# EAGLE design wiseboard (EAGLE 8.2.2)
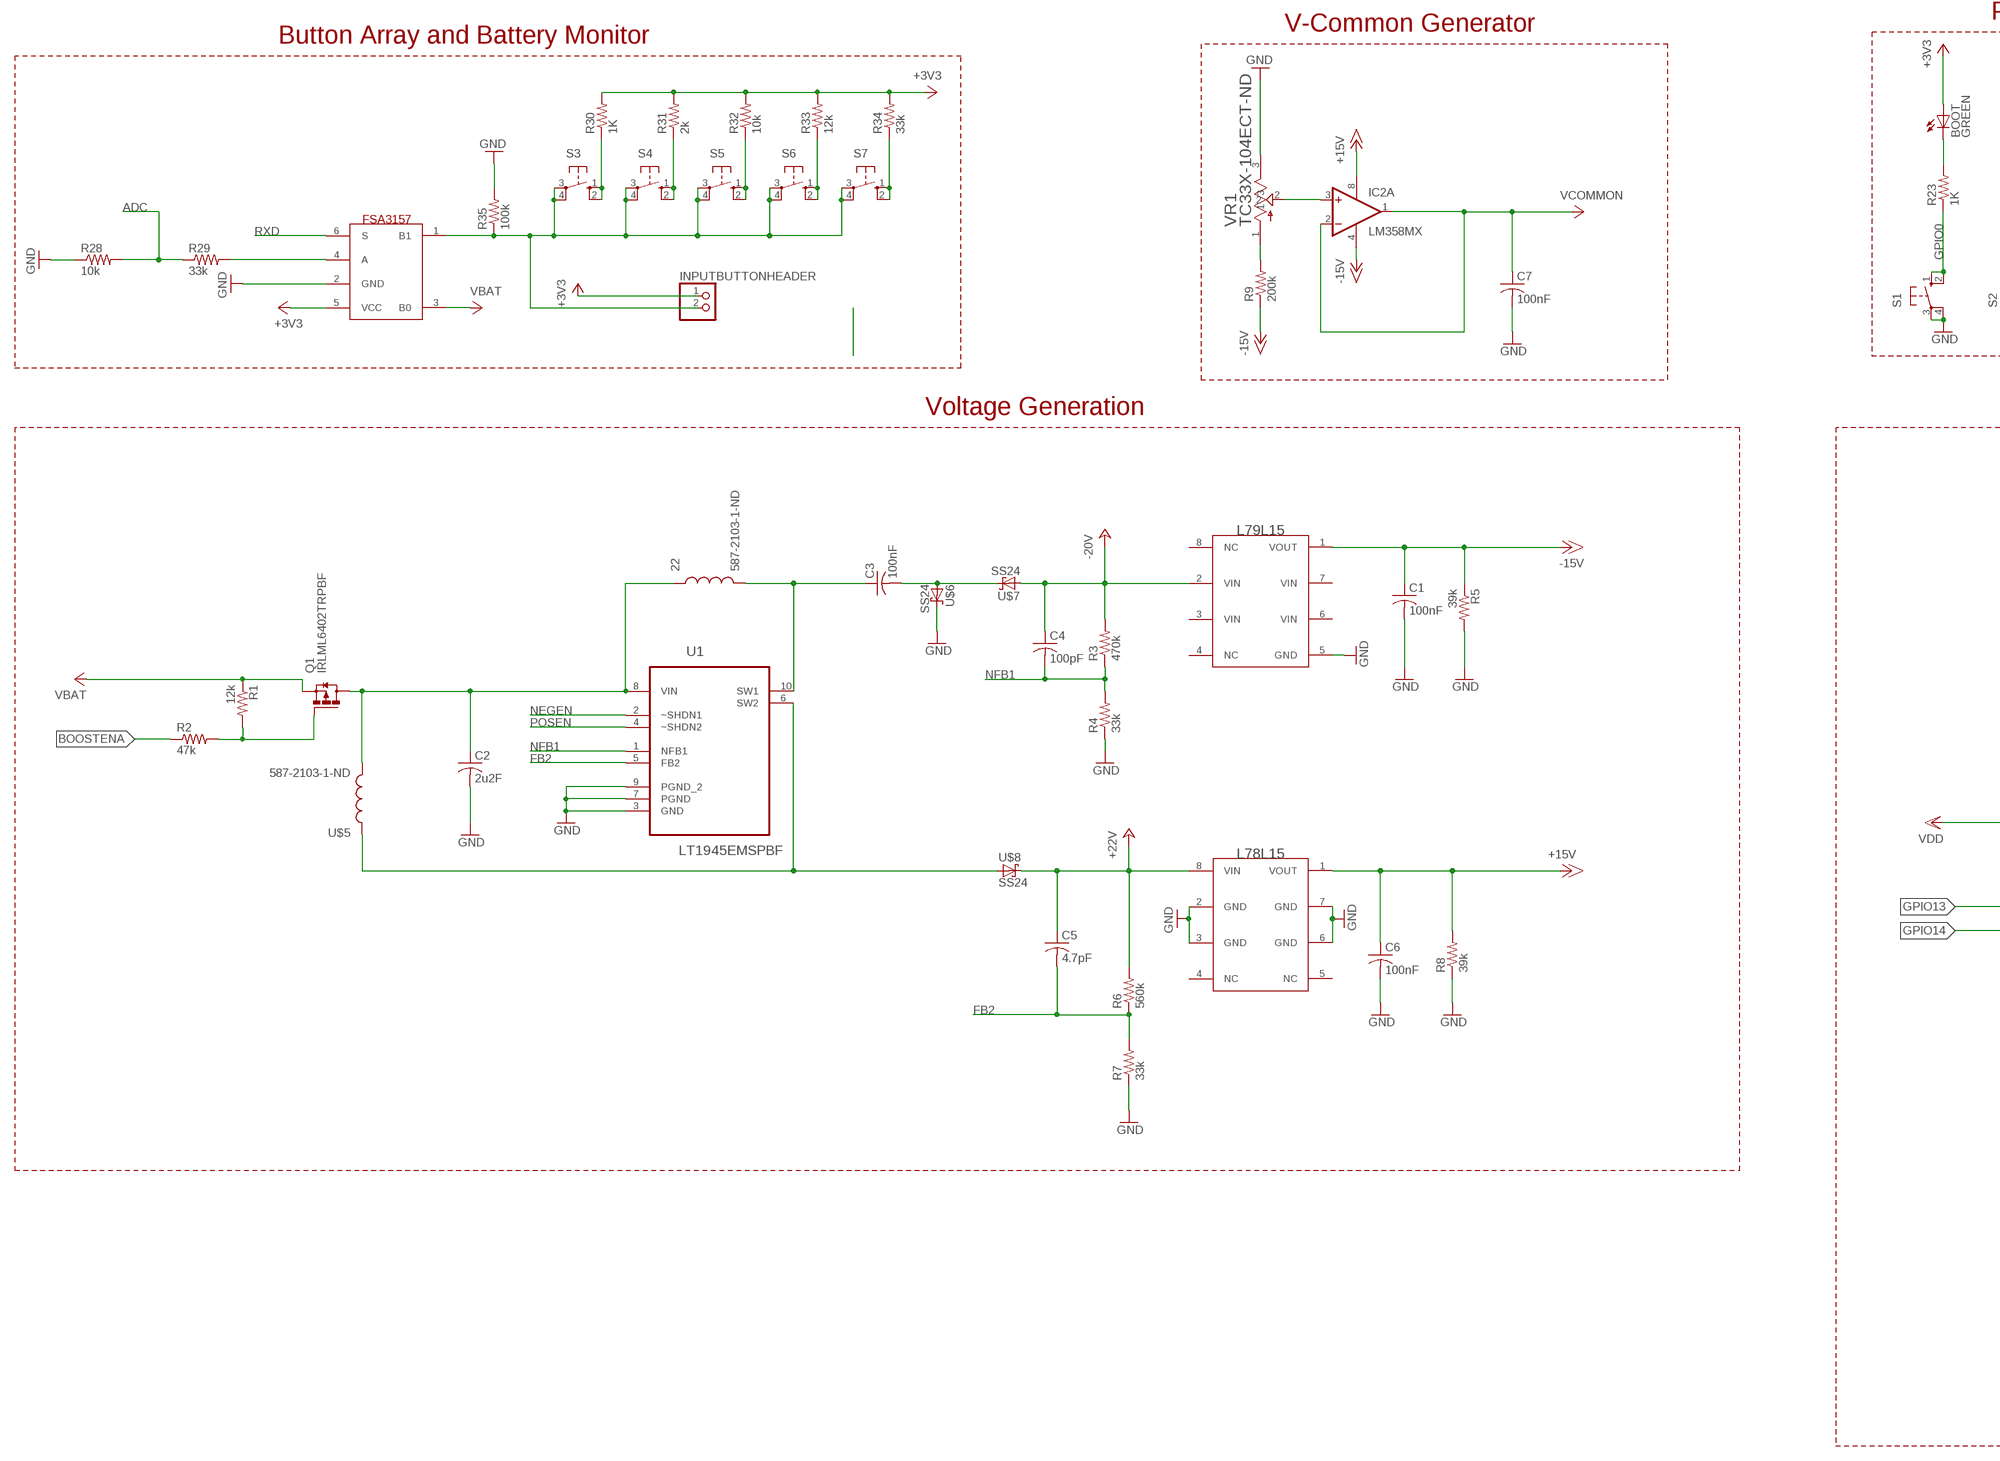
[diagram p0: schematic, sheet 1, part 1 of 2]
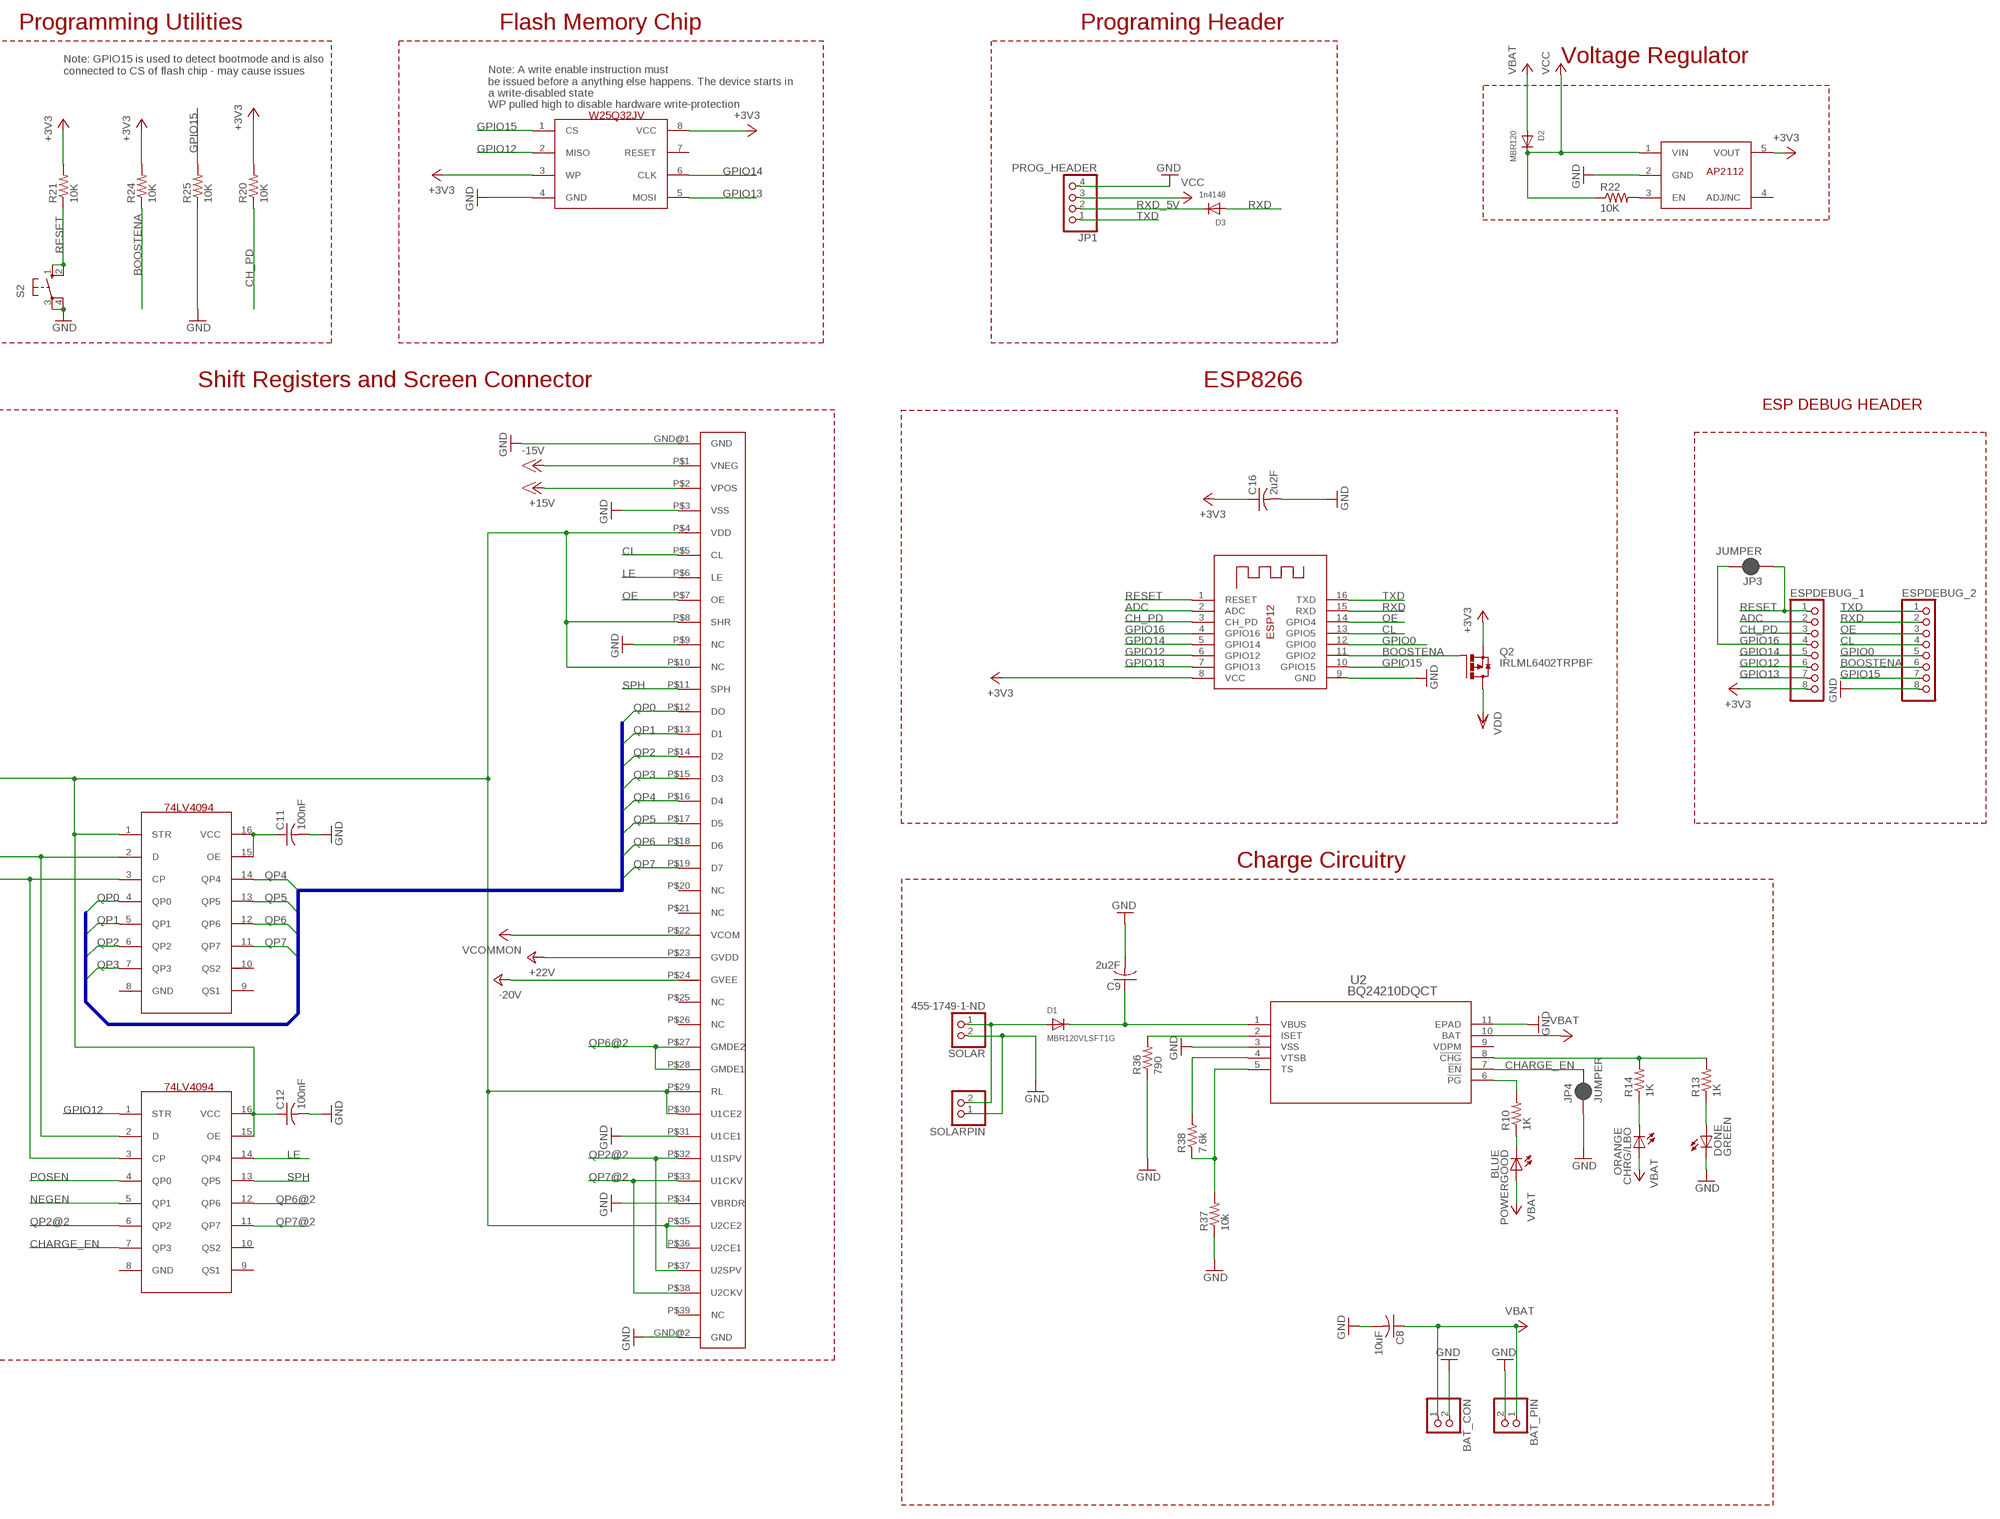
[diagram p1: schematic, sheet 1, part 2 of 2]

## Parts
22  587-2103-1-ND  [587-2103-1-ND]
BAT_CON  JST_2PIN-SMT-RA  [JST-PH-2-SMT-RA]
BAT_PIN  PINHD-1X2  [1X02]
BOOT  GREEN  LEDCHIP-LED0805  [CHIP-LED0805]
C1  100nF  C-USC1206  [C1206]
C2  2u2F  C-USC1206  [C1206]
C3  100nF  C-USC1206  [C1206]
C4  100pF  C-USC1206  [C1206]
C5  4.7pF  C-USC1206  [C1206]
C6  100nF  C-USC1206  [C1206]
C7  100nF  C-USC1206  [C1206]
C8  10uF  C-USC1206  [C1206]
C9  2u2F  C-USC1206  [C1206]
C11  100nF  C-USC1206  [C1206]
C12  100nF  C-USC1206  [C1206]
C16  2u2F  C-USC1206  [C1206]
CHRG/LBO  ORANGE  LEDCHIP-LED0805  [CHIP-LED0805]
D1  MBR120VLSFT1G  DIODESOD-123  [SOD-123]
D2  MBR120  DIODESOD-123  [SOD-123]
D3  1n4148  DIODESOD-123  [SOD-123]
DONE  GREEN  LEDCHIP-LED0805  [CHIP-LED0805]
ESPDEBUG_1  PINHD-1X8  [1X08]
ESPDEBUG_2  PINHD-1X8  [1X08]
IC2  LM358MX  [SO08]
INPUTBUTTONHEADER  PINHD-1X2  [1X02]
JP1  PROG_HEADER  PINHD-1X4  [1X04]
JP3  JUMPER  JUMPER-SMT_2_NC_PASTE_NO-SILK  [SMT-JUMPER_2_NC_PASTE_NO-SILK]
JP4  JUMPER  JUMPER-SMT_2_NC_PASTE_NO-SILK  [SMT-JUMPER_2_NC_PASTE_NO-SILK]
POWERGOOD  BLUE  LEDCHIP-LED0805  [CHIP-LED0805]
Q1  IRLML6402TRPBF  [SOT23]
Q2  IRLML6402TRPBF  [SOT23]
R1  12k  R-US_M1206  [M1206]
R2  47k  R-US_M1206  [M1206]
R3  470k  R-US_M1206  [M1206]
R4  33k  R-US_M1206  [M1206]
R5  39k  R-US_R1206  [R1206]
R6  560k  R-US_R1206  [R1206]
R7  33k  R-US_R1206  [R1206]
R8  39k  R-US_R1206  [R1206]
R9  200k  R-US_M1206  [M1206]
R10  1K  R-US_M1206  [M1206]
R13  1K  R-US_M1206  [M1206]
R14  1K  R-US_M1206  [M1206]
R20  10K  R-US_R1206  [R1206]
R21  10K  R-US_R1206  [R1206]
R22  10K  R-US_R1206  [R1206]
R23  1K  R-US_R1206  [R1206]
R24  10K  R-US_R1206  [R1206]
R25  10K  R-US_R1206  [R1206]
R28  10k  R-US_M1206  [M1206]
R29  33k  R-US_M1206  [M1206]
R30  1K  R-US_M1206  [M1206]
R31  2k  R-US_M1206  [M1206]
R32  10k  R-US_M1206  [M1206]
R33  12k  R-US_M1206  [M1206]
R34  33k  R-US_M1206  [M1206]
R35  100k  R-US_M1206  [M1206]
R36  790  R-US_R1206  [R1206]
R37  10k  R-US_R1206  [R1206]
R38  7.6k  R-US_R1206  [R1206]
S1  10-XX  [B3F-10XX]
S2  10-XX  [B3F-10XX]
S3  10-XX  [B3F-10XX]
S4  10-XX  [B3F-10XX]
S5  10-XX  [B3F-10XX]
S6  10-XX  [B3F-10XX]
S7  10-XX  [B3F-10XX]
SOLAR  455-1749-1-ND  JST_2PIN-SMT-RA  [JST-PH-2-SMT-RA]
SOLARPIN  PINHD-1X2  [1X02]
U1  LT1945EMSPBF  [SOP50P490X110-10N]
U2  BQ24210DQCT  [DQC10_P84X2P4]
U$2  497-7278-1-ND  L78L15  [SO8]
U$3  497-7303-1-ND  L79L15  [SO8]
U$4  HFQ339CT-ND  [HFQ339CT-ND]
U$5  587-2103-1-ND  [587-2103-1-ND]
U$6  SS24  [DO214AA]
U$7  SS24  [DO214AA]
U$8  SS24  [DO214AA]
U$11  1727-3473-ND  74LV4094  [SO16]
U$12  1727-3473-ND  74LV4094  [SO16]
U$13  FSA3157  [SC70-6L]
U$14  AP2112K-3.3TRG1DICT-ND  AP2112  [SOT95P280X145-5N]
U$23  W25Q32JVSSIQ  [SO8]
VR1  TC33X-104ECT-ND  TC33X-2-103E  [TRIM_TC33X-2-103E]
X1  1528-1438-ND  ESP-12  [ESP-12]

## Nets
+3V3: BOOT.A C16.1 ESPDEBUG_1.8 INPUTBUTTONHEADER.1 Q2.2(S) R20.2 R21.2 R24.2 R30.2 R31.2 R32.2 R33.2 R34.2 U$13.5(VCC) U$14.5(VOUT) U$23.3(WP) U$23.8(VCC) X1.8(VCC)
+15V: C6.1 IC2.8(P:V+) R8.2 U$2.1(VOUT) U$4.P$2(VPOS)
+22V: C5.1 R6.2 U$2.8(VIN) U$4.P$23(GVDD) U$8.C
-15V: C1.1 IC2.4(P:V-) R5.1 R9.1 U$3.1(VOUT) U$4.P$1(VNEG)
-20V: C4.1 R3.2 U$3.2(VIN) U$4.P$24(GVEE) U$7.A
ADC: ESPDEBUG_1.2 R28.2 R29.1 X1.2(ADC)
BOOSTENA: ESPDEBUG_2.6 Q2.1(G) R2.1 R24.1 X1.11(GPIO2)
CH_PD: ESPDEBUG_1.3 R20.1 X1.3(CH_PD)
CHARGE_EN: JP4.2 U2.7(!EN) U$12.7(QP3)
CL: ESPDEBUG_2.4 U$4.P$5(CL) X1.13(GPIO5)
FB2: C5.2 R6.1 R7.2 U1.5(FB2)
GND: BAT_CON.2 BAT_PIN.2 C1.2 C2.2 C6.2 C7.2 C8.2 C9.2 C11.2 C12.2 C16.2 DONE.C ESPDEBUG_2.8 JP1.4 JP4.1 R4.1 R5.2 R7.1 R8.1 R25.1 R28.1 R35.2 R36.1 R37.1 S1.3(P) S1.4(P1) S2.3(P) S2.4(P1) SOLAR.2 SOLARPIN.1 U1.3(GND) U1.7(PGND) U1.9(PGND_2) U2.3(VSS) U2.11(EPAD) U$2.2(GND) U$2.3(GND) U$2.6(GND) U$2.7(GND) U$3.5(GND) U$4.GND@1(GND) U$4.GND@2(GND) U$4.P$3(VSS) U$4.P$9(NC) U$4.P$31(U1CE1) U$4.P$34(VBRDR) U$6.C U$13.2(GND) U$14.2(GND) U$23.4(GND) VR1.3 X1.9(GND)
GPIO0: ESPDEBUG_2.5 R23.1 S1.1(S) S1.2(S1) X1.12(GPIO0)
GPIO12: ESPDEBUG_1.6 U$12.1(STR) U$23.2(MISO) X1.6(GPIO12)
GPIO13: ESPDEBUG_1.7 U$11.2(D) U$12.2(D) U$23.5(MOSI) X1.7(GPIO13)
GPIO14: ESPDEBUG_1.5 U$11.3(CP) U$12.3(CP) U$23.6(CLK) X1.5(GPIO14)
GPIO15: ESPDEBUG_2.7 R25.2 U$23.1(CS) X1.10(GPIO15)
GPIO16: ESPDEBUG_1.4 JP3.2 X1.4(GPIO16)
LE: U$4.P$6(LE) U$12.14(QP4)
N$1: IC2.3(A:+IN) VR1.2
N$2: 22.P$2 C3.1 U1.10(SW1)
N$3: Q1.1(G) R1.2 R2.2
N$4: 22.P$1 C2.1 Q1.3(D) U1.8(VIN) U$5.P$2
N$5: U1.6(SW2) U$5.P$1 U$8.A
N$6: C3.2 U$6.A U$7.C
N$7: D1.A SOLAR.1 SOLARPIN.2
N$8: R9.2 VR1.1
N$9: R10.2 U2.6(!PG)
N$10: CHRG/LBO.C R14.1
N$11: POWERGOOD.C R10.1
N$13: C9.1 D1.C U2.1(VBUS)
N$14: DONE.A R13.1
N$15: R13.2 R14.2 U2.8(!CHG)
N$16: C11.1 U$11.15(OE) U$11.16(VCC)
N$17: R36.2 U2.2(ISET)
N$22: BOOT.C R23.2
N$23: R22.2 U$14.3(EN)
N$24: R29.2 U$13.4(A)
N$26: INPUTBUTTONHEADER.2 R35.1 S3.3(P) S3.4(P1) S4.3(P) S4.4(P1) S5.3(P) S5.4(P1) S6.3(P) S6.4(P1) S7.3(P) S7.4(P1) U$13.1(B1)
N$27: R30.1 S3.1(S) S3.2(S1)
N$28: R37.2 R38.1 U2.5(TS)
N$29: R31.1 S4.1(S) S4.2(S1)
N$30: R38.2 U2.4(VTSB)
N$31: R32.1 S5.1(S) S5.2(S1)
N$33: R33.1 S6.1(S) S6.2(S1)
N$35: R34.1 S7.1(S) S7.2(S1)
NEGEN: U1.2(~SHDN1) U$12.5(QP1)
NFB1: C4.2 R3.1 R4.2 U1.1(NFB1)
OE: ESPDEBUG_2.3 U$4.P$7(OE) X1.14(GPIO4)
POSEN: U1.4(~SHDN2) U$12.4(QP0)
QP0: U$4.P$12(DO) U$11.4(QP0)
QP1: U$4.P$13(D1) U$11.5(QP1)
QP2: U$4.P$14(D2) U$11.6(QP2)
QP2@2: U$4.P$32(U1SPV) U$4.P$37(U2SPV) U$12.6(QP2)
QP3: U$4.P$15(D3) U$11.7(QP3)
QP4: U$4.P$16(D4) U$11.14(QP4)
QP5: U$4.P$17(D5) U$11.13(QP5)
QP6: U$4.P$18(D6) U$11.12(QP6)
QP6@2: U$4.P$27(GMDE2) U$4.P$28(GMDE1) U$12.12(QP6)
QP7: U$4.P$19(D7) U$11.11(QP7)
QP7@2: U$4.P$33(U1CKV) U$4.P$38(U2CKV) U$12.11(QP7)
RESET: ESPDEBUG_1.1 JP3.1 R21.1 S2.1(S) S2.2(S1) X1.1(RESET)
RXD: D3.A ESPDEBUG_2.2 U$13.6(S) X1.15(RXD)
RXD_5V: D3.C JP1.2
SPH: U$4.P$11(SPH) U$12.13(QP5)
TXD: ESPDEBUG_2.1 JP1.1 X1.16(TXD)
VBAT: BAT_CON.1 BAT_PIN.1 C8.1 CHRG/LBO.A D2.A POWERGOOD.A Q1.2(S) R1.1 U2.10(BAT) U$13.3(B0)
VCC: D2.C JP1.3 R22.1 U$14.1(VIN)
VCOMMON: C7.1 IC2.1(A:OUT) IC2.2(A:-IN) U$4.P$22(VCOM)
VDD: C12.1 Q2.3(D) U$4.P$4(VDD) U$4.P$8(SHR) U$4.P$10(NC) U$4.P$29(RL) U$4.P$30(U1CE2) U$4.P$35(U2CE2) U$4.P$36(U2CE1) U$11.1(STR) U$12.15(OE) U$12.16(VCC)
Unconnected: IC2.5(B:+IN) IC2.6(B:-IN) IC2.7(B:OUT) U2.9(VDPM) U$2.4(NC) U$2.5(NC) U$3.3(VIN) U$3.4(NC) U$3.6(VIN) U$3.7(VIN) U$3.8(NC) U$4.P$20(NC) U$4.P$21(NC) U$4.P$25(NC) U$4.P$26(NC) U$4.P$39(NC) U$11.9(QS1) U$11.10(QS2) U$12.9(QS1) U$12.10(QS2) U$14.4(ADJ/NC) U$23.7(RESET)

## Buses
QP[0..7]

## Notes on the sheet
- Programming Utilities | Flash Memory Chip | Programing Header
- V-Common Generator
- Button Array and Battery Monitor
- Voltage Regulator
- Note: GPIO15 is used to detect bootmode and is also 
  connected to CS of flash chip - may cause issues
- Note: A write enable instruction must
  be issued before a anything else happens. The device starts in 
  a write-disabled state
- WP pulled high to disable hardware write-protection
- Shift Registers and Screen Connector | ESP8266
- Voltage Generation
- ESP DEBUG HEADER
- Charge Circuitry

## Power pins joined to a net without a drawn wire
GND: U$11.8(GND) U$12.8(GND)

## Library data of the parts
22 U$5 = WISE:587-2103-1-ND
BAT_CON SOLAR = adafruit:JST_2PIN: JST 2-Pin Connectors of various flavors SMT-RA (S2B-PH-SM4) 4UConnector #17311 SMT (B2B-PH-SM4) THM-RA (S2B-PH) THM (B2B-PH)
BAT_PIN INPUTBUTTONHEADER SOLARPIN = pinhead:PINHD-1X2: PIN HEADER
BOOT CHRG/LBO DONE POWERGOOD = adafruit:LED: LED OSRAM: - CHIPLED LG R971, LG N971, LY N971, LG Q971, LY Q971, LO R971, LY R971 LH N974, LH R974 LS Q976, LO Q976, LY Q976 LO Q996 - Hyper CHIPLED LW Q18S LB Q993, LB Q99A, LB R99A - SideLED LS A670, LO A670, LY A670, LG A670, LP A670 LB A673, LV A673, LT A673, LW A673 LH A674 LY A675 LS A676, LA A676, LO A676, LY A676, LW A676 LS A679, LY A679, LG A679 - Hyper Micro SIDELED® LS Y876, LA Y876, LO Y876, LY Y876 LT Y87S - SmartLED LW L88C, LW L88S LB L89C, LB L89S, LG L890 LS L89K, LO L89K, LY L89K LS L896, LA L896, LO L896, LY L896 - TOPLED LS T670, LO T670, LY T670, LG T670, LP T670 LSG T670, LSP T670, LSY T670, LOP T670, LYG T670 LG T671, LOG T671, LSG T671 LB T673, LV T673, LT T673, LW T673 LH T674 LS T676, LA T676, LO T676, LY T676, LB T676, LH T676, LSB T676, LW T676 LB T67C, LV T67C, LT T67C, LS T67K, LO T67K, LY T67K, LW E67C LS E67B, LA E67B, LO E67B, LY E67B, LB E67C, LV E67C, LT E67C LW T67C LS T679, LY T679, LG T679 LS T770, LO T770, LY T770, LG T770, LP T770 LB T773, LV T773, LT T773, LW T773 LH T774 LS E675, LA E675, LY E675, LS T675 LS T776, LA T776, LO T776, LY T776, LB T776 LHGB T686 LT T68C, LB T68C - Hyper Mini TOPLED® LB M676 - Mini TOPLED Santana® LG M470 LS M47K, LO M47K, LY M47K Source: http://www.osram.convergy.de/
C1-C9 C11 C12 C16 = adafruit:C-US: CAPACITOR, American symbol
D1 = microbuilder:DIODE: Diode
D2 D3 = adafruit:DIODE: Diode
ESPDEBUG_1 ESPDEBUG_2 = pinhead:PINHD-1X8: PIN HEADER
IC2 = linear:LM358: OP AMP also LM158; LM258; LM2904 Source: http://cache.national.com/ds/LM/LM158.pdf
JP1 = pinhead:PINHD-1X4: PIN HEADER
JP3 JP4 = Sparkfun-Passives:JUMPER-SMT_2_NC_PASTE: Normally closed solder jumper This jumper has an aperture in the stencil to allow solder paste to bridge the split in the wire so it's normally closed (NC). Wick off the solder to open the connection. Reapply solder to reclose the connection.
Q1 Q2 = IRLML6402:IRLML6402: HEXFET P-Channel Power MOSFET; AVAILABILITY: Unavailable; DESCRIPTION: MOSFETs, Semiconductors and Actives, mosfet, Transistors, Discretes (diodes, transistors, thyristors ...); MF: International Rectifier; MP: IRLML6402; PACKAGE: SOT-23-3 International Rectifier; PRICE: None
R1-R10 R13 R14 R20-R25 R28-R38 = adafruit:R-US_: RESISTOR, American symbol
S1-S7 = switch-omron:10-XX: OMRON SWITCH; MPN: B3F-1000; OC_FARNELL: 176432; OC_NEWARK: 36M3542
U1 = LTC_By_element14_Batch_1:LT1945EMSPBF: Dual Micropower DC/DC Converter with Positive and Converter with Positive and; MPN: LT1945EMS#PBF; OC_FARNELL: 1273495; OC_NEWARK: 57M7266; PACKAGE: MSOP-10; SUPPLIER: Linear Technology
U2 = WISE:BQ24210DQCT; MANUFACTURER_PART_NUMBER: BQ24210DQCT; VENDOR: Vendor
U$2 = WISE:L78L15
U$3 = WISE:L79L15
U$4 = WISE:HFQ339CT-ND
U$6-U$8 = WISE:SS24
U$11 U$12 = WISE:74LV4094
U$13 = WISE:FSA3157
U$14 = WISE:AP2112
U$23 = WISE:W25Q32JVSSIQ
VR1 = WISE:TC33X-2-103E: Res Cermet POT 10K Ohm 25% 0.1W(1/10W) 1(Elec)/1(Mech)Turn 3mm (3 X 3.65 X 1.85mm) Foot Print SMD T/R; AVAILABILITY: Good; DESCRIPTION: Res%20Trimmer%2010K%20Ohm%2025%25%200.1W%281/10W%29%201%28Elec%29/1%28Mech%29Turn%20%283%20X%203.8mm%29%20Foot%20Print%20SMD%20Embossed%20T/R; MF: Bourns; MP: TC33X-2-103E; PACKAGE: None; PRICE: 0.16 USD
X1 = adafruit:ESP-12

## Board
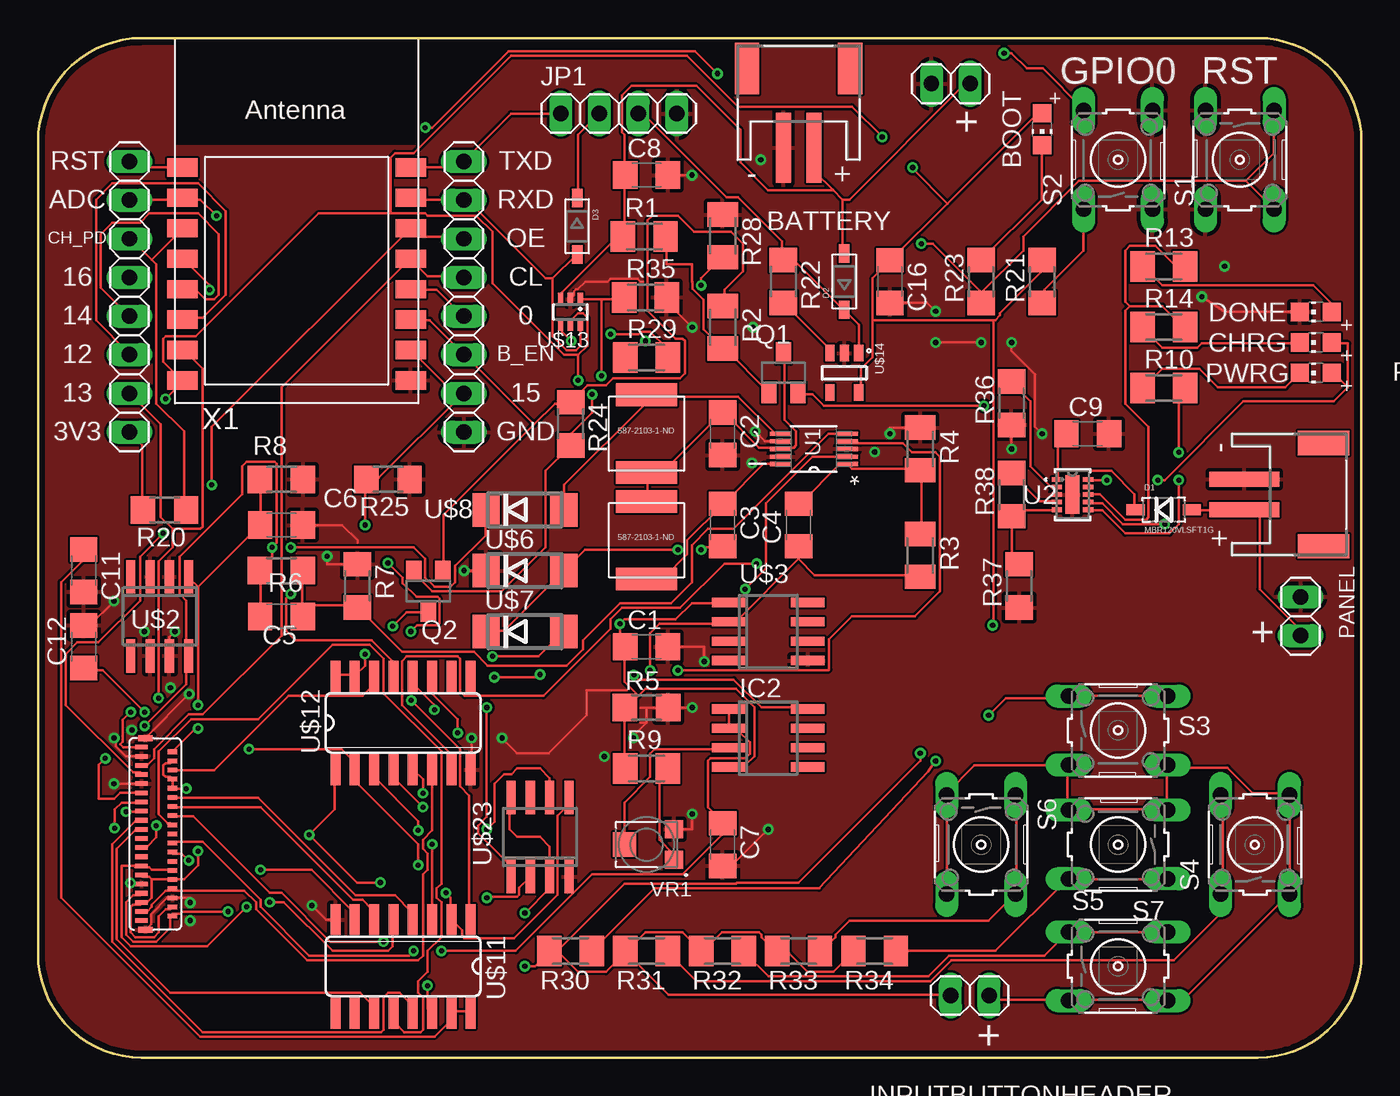
[diagram p2: board, top side]
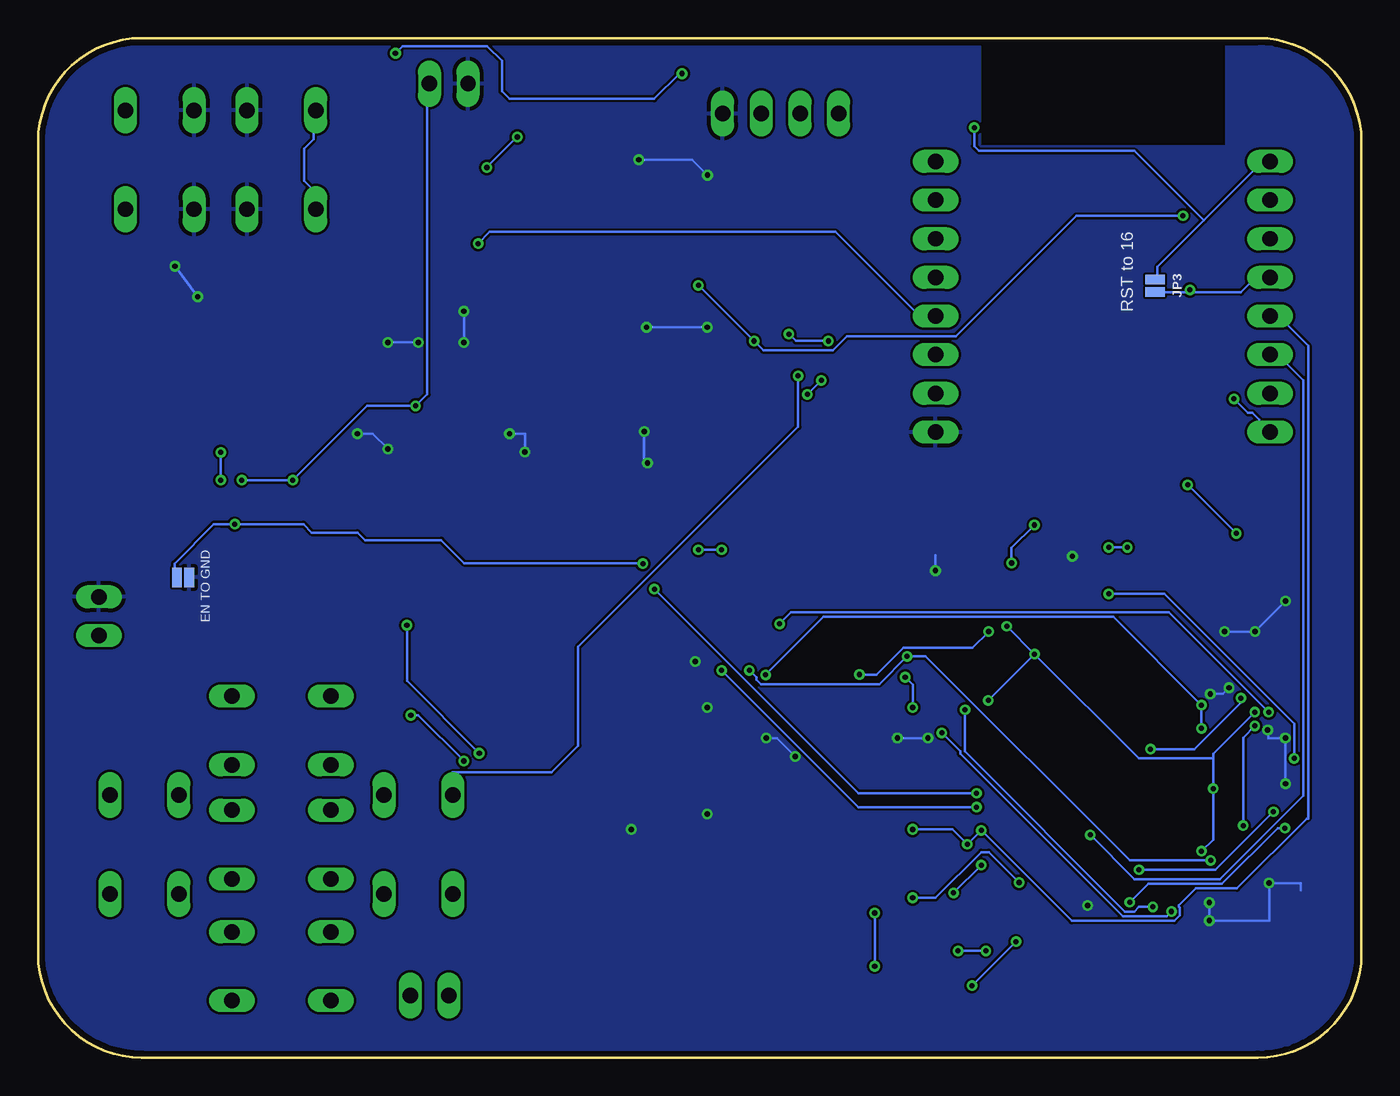
[diagram p3: board, bottom side, seen from below]

Size 87 x 67 mm. Coordinates in mm from the lower left corner, seen from the top.
Outline: 80.17,0 6.83,0 arc-90 0,6.83 0,60.17 arc-90 6.83,67 80.17,67 arc-90 87,60.17 87,6.83 arc-90 80.17,0
Copper layers (1*16): Top 0.0356mm / dielectric 1.5011mm / Bottom 0.0356mm
Design rules "oshpark-2layer": minimum track width 6mil, minimum drill 13mil, track to track 6mil, track to pad 6mil, pad to pad 6mil, via to via 6mil, smd to smd 6mil, copper to edge 15mil, drill to drill 6mil, minimum pad ring 7mil, minimum via ring 7mil, stop-mask expansion 2.5mil, vias tented up to drill 0mil, thermal gap 10mil

### Footprints (pad centres in the part's own frame; a part is rotated, then mirrored left to right if it is on the bottom)
587-2103-1-ND = smd 1.5 x 4: P$1 -2.55,0; P$2 2.55,0
JST-PH-2-SMT-RA = smd 1 x 4.6: 1 1,-3.7; 2 -1,-3.7 | smd 1.6 x 3.4: NC1 -3.4,1.5; NC2 3.4,1.5
1X02 = drill 1.016 long: 1 -1.27,0; 2 1.27,0
CHIP-LED0805 = smd 1.2 x 1.2: A 0,-1.05; C 0,1.05
C1206 = smd 1.6 x 1.8: 1 -1.4,0; 2 1.4,0
SOD-123 = smd 1.2 x 0.7: A 1.85,0; C -1.85,0
1X08 = drill 1.016 long: 1 -8.89,0; 2 -6.35,0; 3 -3.81,0; 4 -1.27,0; 5 1.27,0; 6 3.81,0; 7 6.35,0; 8 8.89,0
SO08 = smd 0.6 x 2.2: 1 -1.905,-2.6; 2 -0.635,-2.6; 3 0.635,-2.6; 4 1.905,-2.6; 5 1.905,2.6; 6 0.635,2.6; 7 -0.635,2.6; 8 -1.905,2.6
1X04 = drill 1.016 long: 1 -3.81,0; 2 -1.27,0; 3 1.27,0; 4 3.81,0
SMT-JUMPER_2_NC_PASTE_NO-SILK = smd 0.635 x 1.27: 1 -0.406,0; 2 0.406,0
SOT23 = smd 1 x 1.4: 1 -0.95,-1.306; 2 0.95,-1.306; 3 0,1.306
M1206 = smd 1.6 x 2: 1 -1.4,0; 2 1.4,0
R1206 = smd 1.6 x 1.803: 1 -1.422,0; 2 1.422,0
B3F-10XX = drill 1.016 long: 1 -3.251,2.261; 2 3.251,2.261; 3 -3.251,-2.261; 4 3.251,-2.261
SOP50P490X110-10N = smd 1.397 x 0.279: 1 -2.184,0.991; 2 -2.184,0.508; 3 -2.184,0; 4 -2.184,-0.508; 5 -2.184,-0.991; 6 2.184,-0.991; 7 2.184,-0.508; 8 2.184,0; 9 2.184,0.508; 10 2.184,0.991
DQC10_P84X2P4 = smd 0.66 x 0.305: 1 -1.029,1; 2 -1.029,0.5; 3 -1.029,0; 4 -1.029,-0.5; 5 -1.029,-1; 6 1.029,-1; 7 1.029,-0.5; 8 1.029,0; 9 1.029,0.5; 10 1.029,1 | smd 0.94 x 2.515: 11 0,0
SO8 = smd 0.6 x 2.2: 1 -1.905,-2.6; 2 -0.635,-2.6; 3 0.635,-2.6; 4 1.905,-2.6; 5 1.905,2.6; 6 0.635,2.6; 7 -0.635,2.6; 8 -1.905,2.6
HFQ339CT-ND = smd 0.4 x 0.95: GND@1 6.6,-0.925; GND@2 -6,-0.925 | smd 0.3 x 0.8: P$1 -5.4,-1.2; P$3 -4.8,-1.2; P$5 -4.2,-1.2; P$7 -3.6,-1.2; P$9 -3,-1.2; P$11 -2.4,-1.2; P$13 -1.8,-1.2; P$15 -1.2,-1.2; P$17 -0.6,-1.2; P$19 0,-1.2; P$21 0.6,-1.2; P$23 1.2,-1.2; P$25 1.8,-1.2; P$27 2.4,-1.2; P$29 3,-1.2; P$31 3.6,-1.2; P$33 4.2,-1.2; P$35 4.8,-1.2; P$37 5.4,-1.2; P$39 6,-1.2 | smd 0.3 x 0.65: P$2 -5.1,0.838; P$4 -4.5,0.838; P$6 -3.9,0.838; P$8 -3.3,0.838; P$10 -2.7,0.838; P$12 -2.1,0.838; P$14 -1.5,0.838; P$16 -0.9,0.838; P$18 -0.3,0.838; P$20 0.3,0.838; P$22 0.9,0.838; P$24 1.5,0.838; P$26 2.1,0.838; P$28 2.7,0.838; P$30 3.3,0.838; P$32 3.9,0.838; P$34 4.5,0.838; P$36 5.1,0.838; P$38 5.7,0.838
DO214AA = smd 1.8 x 2.2: A 2.55,0; C -2.55,0
SO16 = smd 0.66 x 2.032: 1 -4.445,-3.073; 2 -3.175,-3.073; 3 -1.905,-3.073; 4 -0.635,-3.073; 5 0.635,-3.073; 6 1.905,-3.073; 7 3.175,-3.073; 8 4.445,-3.073; 9 4.445,3.073; 10 3.175,3.073; 11 1.905,3.073; 12 0.635,3.073; 13 -0.635,3.073; 14 -1.905,3.073; 15 -3.175,3.073; 16 -4.445,3.073
SC70-6L = smd 0.35 x 0.8: 1 -0.65,-0.85; 2 0,-0.85; 3 0.65,-0.85; 4 0.65,0.85; 5 0,0.85; 6 -0.65,0.85
SOT95P280X145-5N = smd 1.1 x 0.6: 1 -1.3,0.95; 2 -1.3,0; 3 -1.3,-0.95; 4 1.3,-0.95; 5 1.3,0.95
TRIM_TC33X-2-103E = smd 1.2 x 1.2: 1 -1.8,1; 3 -1.8,-1 | smd 1.5 x 1.6: 2 1.45,0
ESP-12 = smd 2 x 1.2: 1 -7.5,4.5; 2 -7.5,2.5; 3 -7.5,0.5; 4 -7.5,-1.5; 5 -7.5,-3.5; 6 -7.5,-5.5; 7 -7.5,-7.5; 8 -7.5,-9.5; 9 7.5,-9.5; 10 7.5,-7.5; 11 7.5,-5.5; 12 7.5,-3.5; 13 7.5,-1.5; 14 7.5,0.5; 15 7.5,2.5; 16 7.5,4.5

### Placement (x,y rotation side)
22  40,34 270 top
BAT_CON  50,63.5 0 top
BAT_PIN  60,64 180 top
BOOT  66,61 180 top
C1  40,27 0 top
C2  45,41 270 top
C3  45,35 270 top
C4  50,35 90 top
C5  16,29 0 top
C6  16,35 0 top
C7  45,14 270 top
C8  40,58 0 top
C9  69,41 0 top
C11  3,32 270 top
C12  3,27 90 top
C16  56,51 270 top
CHRG/LBO  84,47 90 top
D1  74,36 0 top
D2  53,51 90 top
D3  35.44,54.63 270 top
DONE  84,49 90 top
ESPDEBUG_1  6,50 270 top
ESPDEBUG_2  28,50 270 top
IC2  48,21 270 top
INPUTBUTTONHEADER  61.25,4.09 0 top
JP1  38.18,62.04 0 top
JP3  13.56,50.72 270 bottom
JP4  77.47,31.56 180 bottom
POWERGOOD  84,45 90 top
Q1  49,45 0 top
Q2  25.66,30.66 180 top
R1  39.85,53.96 0 top
R2  45,48 270 top
R3  58,33 270 top
R4  58,40 270 top
R5  40,23 0 top
R6  16,32 180 top
R7  21,31 270 top
R8  16,38 180 top
R9  40,19 0 top
R10  74,44 0 top
R13  74,52 0 top
R14  74,48 0 top
R20  8.32,35.99 180 top
R21  66,51 90 top
R22  49,51 270 top
R23  62,51 90 top
R24  35.01,41.64 270 top
R25  23,38 180 top
R28  45,54 270 top
R29  40,46 0 top
R30  35,7 180 top
R31  40,7 180 top
R32  45,7 180 top
R33  50,7 180 top
R34  55,7 180 top
R35  39.93,49.96 0 top
R36  64,43 90 top
R37  64.5,31 90 top
R38  64,37 90 top
S1  79,59 270 top
S2  71,59 90 top
S3  71,21.5 0 top
S4  80,14 90 top
S5  71,6 0 top
S6  62,14 270 top
S7  71,14 180 top
SOLAR  83,37 270 top
SOLARPIN  83,29 270 top
U1  51,40 180 top
U2  68,37 0 top
U$2  8,29 180 top
U$3  48,28 270 top
U$4  8,15 270 top
U$5  40,41 270 top
U$6  32,32 0 top
U$7  32,28 0 top
U$8  32,36 0 top
U$11  24,6 180 top
U$12  24,22 0 top
U$13  35,49 180 top
U$14  53,45 270 top
U$23  33,14.5 0 top
VR1  40,14 180 top
X1  17,54 0 top

### Tracks (layer width: path | path; a pad name or v marks a point on that pad's centre or on a via)
+3V3  (via drill 0.33, 0.35)
  Top 0.152: R34.2 53.49,6.86 52.27,5.64 50.6,5.64 49.38,6.86 48.62,6.86 R33.2 48.46,7.01 47.55,7.92 47.55,8.08 47.4,8.23 44.96,8.23 43.74,7.01 R32.2 43.59,7.01 42.37,8.23 39.93,8.23 38.71,7.01 R31.2 | 34.29,6.86 33.68,6.86 33.63,6.94 | 34.29,6.86 35.51,5.64 37.34,5.64 38.56,6.86 R31.2 | 33.63,6.94 R30.2 34.29,6.86 | INPUTBUTTONHEADER.1 59.89,4.12 41.45,4.12 38.71,6.86 R31.2 | 54.86,48.46 54.86,51.21 55.93,52.27 C16.1 56.08,52.43 59.78,56.13 | 54.86,48.46 54.86,46.02 54.1,45.26 54.1,43.74 U$14.5 | 65.68,62.03 65.99,62.03 BOOT.A 65.68,62.03 | 59.78,56.13 65.68,62.03 | 54.86,48.46 62.79,48.46 | 62.79,48.46 62.94,48.46 63.25,48.77 63.25,48.92 65.99,51.66 65.99,52.27 R21.2 | Q2.2 24.84,31.85 25.15,31.55 25.15,31.39 25.91,30.63 30.48,30.63 33.38,33.53 33.38,38.56 34.9,40.08 R24.2 35.05,40.23 35.05,41 36.42,42.37 v36.42,43.59 | R20.2 6.86,36.12 6.86,40.23 6.1,41 ESPDEBUG_1.8 | 35.51,46.18 36.12,46.79 36.12,48.62 35.81,48.92 35.51,48.92 35.05,48.46 35.05,48.16 U$13.5 | 35.51,46.18 34.59,46.18 29.87,50.9 29.87,54.25 28.8,55.32 25.6,55.32 25.45,55.47 23.16,55.47 | 23.16,55.47 18.44,55.47 10.36,47.4 8.38,47.4 8.23,47.24 8.23,45.72 9.45,44.5 X1.8 9.45,44.35 v8.38,43.28 | 35.51,46.18 v35.51,44.5 | 23.16,55.47 23.16,59.13 23.47,59.44 24.69,59.44 31.09,65.84 42.66,65.84 46,62.5 53.5,62.5 v55.5,60.5 | 34.29,6.86 34.29,7.16 38.56,11.43 45.87,11.43 45.94,11.5 50,11.5 58,19.5 v58,20 | 62.79,48.46 62.79,28.45 | 62.79,28.45 62.79,28.35 | 62.79,28.45 v62.75,28.41 | v57.5,58.5 57.5,58.41 59.78,56.13 | v32,9.5 33.63,11.13 U$23.3 33.63,13.87 33,14.5 31.5,14.5 31,15 31,17 U$23.8 | v32,6 32.69,6 33.63,6.94
  Bottom 0.152: v8.38,43.28 7.47,42.37 7.16,42.37 6.71,41.91 6.71,41.76 6.1,41.15 ESPDEBUG_1.8 | v35.51,44.5 v36.42,43.59 | v62.75,28.41 62.75,24.75 v58,20 | v55.5,60.5 v57.5,58.5 | v32,9.5 v32,6
+15V  (via drill 0.33)
  Top 0.152: R8.2 14.63,37.95 14.63,35.05 C6.1 14.48,34.9 10.52,30.94 | v10.52,21.64 10.36,21.64 8.84,20.12 U$4.P$2 | 10.52,30.94 v10.52,23.16 | 10.52,30.94 9.91,31.55 U$2.1 | v39.17,25.15 39.47,24.84 45.72,24.84 47.55,23.01 50.6,23.01 IC2.8
  Bottom 0.152: v10.52,21.64 v10.52,23.16 16.31,28.96 35.36,28.96 v39.17,25.15
+22V  (via drill 0.33)
  Top 0.152: v7.77,15.24 7.77,14.48 7.16,13.87 6.86,13.87 U$4.P$23 | v7.01,21.79 9.75,24.54 9.75,26.36 U$2.8 9.75,26.52 9.75,30.02 9.3,30.48 9.3,32.92 13.41,37.03 13.41,38.86 13.72,39.17 15.54,39.17 15.7,39.01 15.7,33.83 v15.39,33.53 15.39,32.77 14.63,32 R6.2 14.63,31.85 14.63,29.11 C5.1 | v16.61,33.53 24.69,33.53 25.45,32.77 25.45,31.55 26.06,30.94 27.13,30.94 27.43,31.24 27.43,32.31 29.41,34.29 29.41,35.97 U$8.C
  Bottom 0.152: v7.77,15.24 7.77,21.03 v7.01,21.79 | v15.39,33.53 v16.61,33.53
-15V  (via drill 0.33)
  Top 0.152: R9.1 38.56,19.05 38.56,22.86 R5.1 38.71,23.01 39.47,23.77 | 39.47,23.77 39.93,24.23 45.87,24.23 47.09,23.01 47.09,19.81 46.48,19.2 45.41,19.2 IC2.4 | 6.55,20.42 6.71,20.42 U$4.P$1 5.6,20.4 5.41,20.59 5.58,20.76 5.58,22.19 v6.1,22.71 | U$3.1 45.26,29.87 42.98,29.87 41.91,28.8 38.56,28.8 v38.25,28.5 38.25,27.43 38.56,27.13 C1.1 38.56,26.98 38.56,24.69 39.47,23.77
  Bottom 0.152: v6.1,22.71 12.65,29.26 37.49,29.26 v38.25,28.5
-20V  (via drill 0.33)
  Top 0.152: 49.99,32.77 49.99,33.53 C4.1 | 49.99,32.77 45.87,28.65 45.41,28.65 U$3.2 45.26,28.5 40.84,28.5 40.23,27.89 v40.23,25.45 | 49.99,32.77 51.05,31.7 57.91,31.7 R3.2 | v9.91,12.95 9.45,13.41 8.84,13.41 U$4.P$24 | v29.87,26.36 32.92,26.36 34.44,27.89 U$7.A
  Bottom 0.152: v9.91,12.95 15.24,12.95 28.65,26.36 v29.87,26.36 31.7,24.54 39.47,24.54 39.78,24.84 39.78,24.99 v40.23,25.45
ADC  (via drill 0.33)
  Top 0.152: ESPDEBUG_1.2 6.1,56.39 9.45,56.39 X1.2 9.6,56.39 10.67,56.39 v11.73,55.32 | v39.93,47.09 39.78,47.09 38.71,46.02 R29.1 | v43.59,50.75 43.59,51.21 44.96,52.58 R28.2
  Bottom 0.152: v43.59,50.75 v39.93,47.09 39.32,46.48 34.75,46.48 33.83,47.4 26.67,47.4 18.75,55.32 v11.73,55.32
BOOSTENA
  Top 0.152: X1.11 24.54,48.46 25.76,48.46 27.89,46.33 ESPDEBUG_2.6 28.04,46.18 32.61,41.6 | 32.61,41.6 33.98,42.98 34.9,42.98 R24.1 35.05,43.13 36.12,44.2 37.34,44.2 37.8,44.65 42.22,44.65 42.52,44.96 42.52,47.09 42.37,47.24 41.91,47.24 40.08,49.07 40.08,55.02 40.39,55.32 42.06,55.32 43.13,54.25 45.57,54.25 46.33,53.49 46.33,51.66 45.11,50.44 45.11,49.53 R2.1 | 32.61,41.6 26.67,35.66 26.67,32 Q2.1
CH_PD
  Top 0.152: 7.47,52.43 6.1,53.8 ESPDEBUG_1.3 | 7.47,52.43 7.77,52.12 7.77,42.98 9.6,41.15 9.6,36.12 R20.1 | 7.47,52.43 9.45,54.41 X1.3
CHARGE_EN  (via drill 0.33)
  Top 0.152: v74.07,35.05 71.32,35.05 69.95,36.42 69.04,36.42 U2.7 | v47.24,32.46 45.11,32.46 42.22,29.57 38.41,29.57 37.64,28.8 37.64,28.19 33.22,23.77 28.04,23.77 27.74,24.08 27.74,26.21 27.58,26.36 24.23,26.36 23.93,26.06 23.93,23.16 27.13,19.96 27.13,19.05 U$12.7
  Bottom 0.152: v74.07,35.05 75,35.05 | 75,35.05 75.44,35.05 78.03,32.46 78.03,31.85 77.88,31.7 JP4.2 | v47.24,32.46 47.28,32.5 59,32.5 60.5,34 65.5,34 66,34.5 69,34.5 69.55,35.05 75,35.05
CL
  Top 0.152: U$4.P$5 6.86,19.2 7.16,19.2 7.62,19.66 7.62,20.27 9.91,22.55 10.82,22.55 16,27.74 16,44.04 24.38,52.43 X1.13 24.54,52.43 25.6,51.36 27.89,51.36 ESPDEBUG_2.4
FB2
  Top 0.152: 17.37,29.72 17.37,31.85 R6.1 | 17.37,29.72 17.37,29.11 C5.2 17.37,29.72 | U1.5 53.03,41 51.97,41 45.72,34.75 44.04,34.75 42.98,33.68 42.98,31.24 41.6,29.87 38.25,29.87 35.81,27.43 35.81,26.82 34.75,25.76 29.57,25.76 28.65,26.67 23.93,26.67 21.03,29.57 R7.2 20.88,29.72 17.37,29.72
GND  (via drill 0.35)
  Top 0.152: C6.2 20,35 21,34 21,33.83 | U$6.C v28.01,32 | R7.1 19,32.42 v19,32.95 | VR1.3 43,15 v43,16 | C7.2 45.6,12.6 v48,15 | v43,23 R5.2 40,23 | C1.2 43.8,27 v43.8,26.03 | 39.6,22 40,22 | 39.61,23 40,23 | 40,23 40,22 | 38.69,24.13 36.05,24.13 36.05,22.5 33.55,20 31.5,20 v30.5,21 | 40,22 39.14,21.14 v39.14,21 | DONE.C 78,49 v76.5,50 | U$13.2 35.25,50.1 35.25,50.34 35.38,50.48 35.48,50.48 36,51 37.45,51 37.63,51.19 39.42,51.19 39.61,51 39.78,51 | R4.1 56,41.4 v56,41 | U$4.GND@1 7.43,8.76 7.43,9.44 8.49,10.5 U$4.P$34 10,10.5 v10,10.18 | U$4.P$31 6.07,11.4 v6.07,11.47 | U$11.8 18.93,9.07 v18,10 | U$4.P$9 v5,18 | v5,21 5.11,20.89 5.11,20.46 5.77,19.8 U$4.P$3 | U$4.GND@2 7.08,21.04 v9.93,23.89 | U$2.7 8.63,27.64 v9,28 | U1.7 47.79,40.51 v47.15,41.15 | C16.2 58.45,49.6 v59,49.05 | v59,47 v62,47 | v66,41 65.53,41.47 65.53,44.91 64,46.45 v64,47 | v64,40 R36.1 | C12.2 3.4,28.4 v5,30 | C8.2 v42.98,58 v42.99,57.99 | R35.2 41.33,49.67 v43,48 | v28.5,21 28.5,18.98 U$12.8
  Bottom 0.152: v28.01,32 v28,32 28,33 | v39.14,21 38.43,21 v37.22,19.78 | v76.5,50 v78,52 | v56,41 55,41 v55,39.8 | 4,11 4,11.47 v6.07,11.47 6.07,9 v10,9 v10,10.18 | v5,18 v5,21 6.14,21 v6.16,21.53 | v9.93,23.89 9.11,23.89 v8.7,24.3 | 7.02,28 v9,28 | 7.02,28 v7,28 | v47.15,41.15 47.15,39.28 v46.93,39.07 | v59,49.05 v59,47 | v62,47 v64,47 | v66,41 65,41 v64,40 | v5,30 5.02,30 7.02,28 | v42.99,57.99 44,59 v47.5,59 | v43,48 v47,48 | v30.5,21 v28.5,21
  pour Top: 0,67 0,0 87,0 87,67
  pour Bottom: 87,67 87,0 0,0 0,67
GPIO0  (via drill 0.33)
  Top 0.152: X1.12 24.54,50.44 26.21,50.44 27.89,48.77 ESPDEBUG_2.5 | 62.03,50.29 62.03,49.68 R23.1 62.03,50.29 | 62.03,50.29 64.77,53.03 64.77,53.95 68.43,57.61 79.4,57.61 | 79.4,57.61 81.23,55.78 S1.2 | 79.4,57.61 81.23,59.44 81.23,62.18 S1.1 | v58.06,53.49 58.83,53.49 62.03,50.29
  Bottom 0.152: v58.06,53.49 57.3,54.25 34.59,54.25 29.11,48.77 28.04,48.77 ESPDEBUG_2.5
GPIO12  (via drill 0.33, 0.35)
  Top 0.152: X1.6 9.6,48.62 10.82,48.62 12.34,50.14 12.34,55.63 10.52,57.45 4.88,57.45 3.81,56.39 3.81,48.46 5.94,46.33 ESPDEBUG_1.6 | U$12.1 19.51,18.9 19.51,16.31 v17.83,14.63 20.96,11.5 v22.5,11.5 | U$23.2 31.62,11.16 31.62,10.71 31.49,10.57 29.57,10.57 v29.5,10.5
  Bottom 0.152: v17.83,14.63 14.94,11.73 9.3,11.73 3.81,17.22 3.81,44.5 5.49,46.18 5.94,46.18 ESPDEBUG_1.6 | v29.5,10.5 28,10.5 25,13.5 24.5,13.5 v22.5,11.5
GPIO13  (via drill 0.33)
  Top 0.152: 8.84,34.75 10.67,34.75 10.82,34.9 10.82,45.26 9.6,46.48 X1.7 | 8.84,34.75 8.08,35.51 8.08,41.6 6.1,43.59 ESPDEBUG_1.7 | v26.82,10.82 27.13,10.52 27.13,9.14 U$11.2 27.89,8.36 27.89,7.96 28.02,7.83 31.29,7.83 34.16,10.71 34.16,15.9 34.91,16.65 U$23.5 | v24.99,12.65 24.99,14.02 20.88,18.14 20.88,18.9 U$12.2 20.73,19.05 20.73,19.51 19.96,20.27 v13.87,20.27 | 8.84,34.75 8.84,33.53 7.92,32.61 v7.92,23.62
  Bottom 0.152: v24.99,12.65 v26.82,10.82 | v7.92,23.62 7.92,23.32 10.97,20.27 v13.87,20.27
GPIO14  (via drill 0.33, 0.35)
  Top 0.152: X1.5 9.6,50.44 10.36,50.44 10.97,49.84 11.58,49.84 11.89,50.14 11.89,54.1 10.52,55.47 7.32,55.47 6.71,54.86 4.88,54.86 4.12,54.1 4.12,50.6 5.94,48.77 ESPDEBUG_1.5 | v25.91,14.02 25.91,9.14 U$11.3 | v24.99,14.94 24.99,15.54 22.1,18.44 22.1,18.9 U$12.3 | U$23.6 33.63,18.36 33,19 31.5,19 31.13,18.62 30.62,18.62 30,18 30,15.5 v29.5,15
  Bottom 0.152: ESPDEBUG_1.5 5.94,48.62 5.33,48.62 3.5,46.79 3.5,15.7 3.61,15.7 8.18,11.12 10.88,11.12 12,10 12,9.91 11.93,9.84 11.93,9.36 12.3,8.99 19.05,8.99 v24.99,14.94 v25.91,14.02 26.89,15 v29.5,15
GPIO15  (via drill 0.35)
  Top 0.152: 27.74,43.43 27.89,43.59 ESPDEBUG_2.7 27.74,43.43 | 27.74,43.43 22.4,38.1 21.64,38.1 21.61,38.06 | 21.61,38.06 R25.2 | 27.74,43.43 27.58,43.43 24.54,46.48 X1.10 | v29.5,23 29.5,15.82 28.92,15.24 28.92,14.76 31.09,12.58 U$23.1 | v30,25 32.83,25 v33,25.17 | v23,32.5 23.98,31.52 23.98,31.17 24.87,30.28 26.25,30.28 26.39,30.15 26.39,28.56 26.25,28.43 24.93,28.43 v24.5,28 | v21.5,35 21.5,37.94 21.61,38.06
  Bottom 0.152: v29.5,23 29.5,24.5 v30,25 | v33,25.17 31.87,25.17 30.11,26.94 25.56,26.94 v24.5,28 | v23,32.5 23,33.5 v21.5,35
GPIO16  (via drill 0.33)
  Top 0.152: v11.28,50.44 11.28,50.75 9.6,52.43 X1.4
  Bottom 0.152: 11.28,50.29 7.92,50.29 7.01,51.21 6.1,51.21 ESPDEBUG_1.4 | 11.28,50.29 13.41,50.29 JP3.2 | 11.28,50.29 v11.28,50.44
LE
  Top 0.152: U$4.P$6 11.58,18.9 16.46,23.77 21.34,23.77 21.95,24.38 21.95,24.99 U$12.14
N$1
  Top 0.152: VR1.2 38.56,14.02 38.56,16.76 40.23,18.44 40.23,19.96 40.54,20.27 45.26,20.27 IC2.3
N$2
  Top 0.152: U1.10 48.77,39.01 47.7,39.01 45.11,36.42 C3.1 44.96,36.27 42.67,33.98 42.67,33.07 41.15,31.55 40.08,31.55 22.P$2
N$3
  Top 0.152: Q1.1 48.01,43.74 45.11,46.63 R2.2 44.96,46.63 43.74,47.85 43.74,49.79 43.02,50.51 43.02,50.98 43,51 43,52.12 41.3,52.12 41.3,53.95 R1.2
N$4
  Top 0.152: 22.P$1 40.08,36.58 40.08,38.41 U$5.P$2 40.08,38.56 41.15,38.56 44.96,42.37 C2.1 45.11,42.37 47.4,40.08 48.77,40.08 U1.8 48.92,40.08 49.68,40.08 49.84,40.23 49.84,41.15 49.07,41.91 49.07,46.18 Q1.3
N$5
  Top 0.152: U1.6 48.77,41 48.46,41 46.02,43.43 40.08,43.43 U$5.P$1 39.93,43.43 39.93,42.98 34.59,37.64 34.59,36.12 U$8.A
N$6  (via drill 0.33)
  Top 0.152: v43.59,33.38 43.74,33.53 44.96,33.53 C3.2 | v42.06,33.38 35.97,33.38 34.59,32 U$6.A 34.44,31.85 30.63,28.04 29.57,28.04 U$7.C
  Bottom 0.152: v42.06,33.38 v43.59,33.38
N$7
  Top 0.152: D1.A 75.89,35.97 80.16,35.97 SOLAR.1 80.31,35.97 80.31,30.79 82.91,28.19 82.91,27.74 SOLARPIN.2
N$8
  Top 0.152: VR1.1 41.76,13.11 41.76,13.41 40.84,14.33 40.84,18.44 41.3,18.9 R9.2
N$9  (via drill 0.33)
  Top 0.152: v74.98,37.95 74.98,35.05 74.37,34.44 71.48,34.44 69.95,35.97 69.04,35.97 U2.6 | v74.98,39.78 74.98,43.59 75.29,43.89 R10.2
  Bottom 0.152: v74.98,39.78 v74.98,37.95
N$10
  Top 0.152: R14.1 72.69,47.85 73.91,46.63 76.2,46.63 76.5,46.94 82.89,46.94 CHRG/LBO.C
N$11
  Top 0.152: R10.1 72.69,44.04 73.91,45.26 76.35,45.26 77.57,44.04 81.99,44.04 POWERGOOD.C
N$13
  Top 0.152: 67.06,38.56 67.06,40.54 67.51,41 C9.1 | 67.06,38.56 67.06,38.1 U2.1 | 67.06,38.56 70.56,38.56 72.08,37.03 72.08,36.12 D1.C
N$14
  Top 0.152: 85.43,49.14 83.82,50.75 73.91,50.75 72.69,51.97 R13.1 | 85.43,49.14 85.5,49.07 | DONE.A 85.29,49 85.43,49.14
N$15
  Top 0.152: 71.78,49.38 71.48,49.07 71.48,42.98 73,41.45 73,35.51 72.85,35.36 71.48,35.36 69.8,37.03 69.04,37.03 U2.8 | 71.78,49.38 73.91,49.38 75.29,48.01 R14.2 | 71.78,49.38 71.48,49.68 71.48,53.03 71.78,53.34 73.46,53.34 74.68,52.12 75.29,52.12 R13.2
N$16
  Top 0.152: C11.1 2.9,33.38 2.9,32.61 1.52,31.24 1.52,10.52 10.67,1.37 26.06,1.37 27.13,2.44 27.13,2.9 U$11.15 27.28,3.05 28.35,3.05 U$11.16
N$17
  Top 0.152: U2.2 66.9,37.49 66.6,37.49 65.23,38.86 65.23,43.13 64.01,44.35 R36.2
N$22
  Top 0.152: BOOT.C 65.99,59.89 65.99,56.39 62.03,52.43 R23.2
N$23
  Top 0.152: U$14.3 51.97,46.33 51.97,46.63 49.07,49.53 R22.2
N$24  (via drill 0.33)
  Top 0.152: v35.05,47.09 34.44,47.7 34.44,48.01 U$13.4 | v37.64,47.55 39.47,47.55 39.62,47.7 40.23,47.7 41.3,46.63 41.3,46.02 R29.2
  Bottom 0.152: v35.05,47.09 37.19,47.09 v37.64,47.55
N$26  (via drill 0.33)
  Top 0.152: INPUTBUTTONHEADER.2 62.64,3.96 62.79,3.81 67.67,3.81 S5.3 67.82,3.81 74.22,3.81 S5.4 74.37,3.81 75.29,3.81 82.14,10.67 S4.3 82.3,10.82 82.3,17.22 S4.4 82.14,17.37 79.86,17.37 78.18,19.05 74.22,19.05 | 74.22,19.05 74.22,16.31 | 74.22,19.05 74.07,19.2 S3.4 74.22,19.05 | 74.22,16.31 67.82,16.31 S7.4 67.67,16.31 67.67,19.05 67.51,19.2 S3.3 67.36,19.2 61.57,19.2 59.74,17.37 S6.3 59.74,17.22 59.74,10.82 S6.4 | 74.22,16.31 S7.3 | 37.03,49.84 38.41,49.84 R35.1 | 37.03,49.84 35.66,49.84 U$13.1 | v37.03,44.81 37.03,49.84
  Bottom 0.152: v37.03,44.81 37.03,41.45 51.5,26.99 51.5,20.5 53.26,18.75 59.74,18.75 59.74,17.37 S6.3
N$27  (via drill 0.35)
  Top 0.152: 51.33,11.12 51.36,11.12 | 51.33,11.12 40.54,11.12 36.42,7.01 R30.1 | S3.2 73.91,23.77 67.51,23.77 S3.1 67.36,23.62 63.62,23.62 v62.5,22.5 | v59,19.5 58.5,18.8 51.33,11.12
  Bottom 0.152: v62.5,22.5 62,22.5 v59,19.5
N$28
  Top 0.152: U2.5 66.9,35.97 64.31,35.97 64.01,35.66 R38.1 64.01,35.51 64.01,32.46 R37.2
N$29
  Top 0.152: R31.1 41.45,6.86 43.28,5.03 58.67,5.03 60.05,6.4 74.68,6.4 77.72,9.45 77.72,10.67 S4.1 77.88,10.82 77.88,17.22 S4.2
N$30
  Top 0.152: U2.4 66.9,36.58 65.84,36.58 64.01,38.41 R38.2
N$31
  Top 0.152: R32.1 46.48,6.86 48.01,5.33 58.52,5.33 59.89,6.71 66.14,6.71 67.67,8.23 S5.1 67.82,8.23 74.22,8.23 S5.2
N$33
  Top 0.152: R33.1 51.51,7.01 52.43,7.92 52.43,8.08 53.34,8.99 62.48,8.99 64.16,10.67 S6.2 64.31,10.82 64.31,17.22 S6.1
N$35
  Top 0.152: R34.1 56.54,7.01 62.94,7.01 67.67,11.73 S7.2 67.82,11.73 74.22,11.73 S7.1
NEGEN  (via drill 0.33)
  Top 0.152: v46.48,30.79 47.85,32.16 47.85,36.42 50.9,39.47 53.03,39.47 U1.2 | v25.3,17.37 25.3,18.29 24.69,18.9 U$12.5
  Bottom 0.152: v46.48,30.79 33.07,17.37 v25.3,17.37
NFB1
  Top 0.152: R3.1 58.06,34.44 58.06,38.56 R4.2 57.91,38.71 53.49,38.71 U1.1 53.03,39.01 52.73,39.01 50.14,36.42 C4.2
OE  (via drill 0.33)
  Top 0.152: v8.23,34.44 6.71,32.92 6.71,30.02 3.96,27.28 2.59,27.28 1.83,26.52 1.83,23.16 6.25,18.75 6.71,18.75 U$4.P$7 | v11.43,37.64 11.43,41.45 24.38,54.41 X1.14 24.54,54.41 24.99,53.95 27.89,53.95 ESPDEBUG_2.3
  Bottom 0.152: v11.43,37.64 v8.23,34.44
POSEN  (via drill 0.33)
  Top 0.152: v42.06,25.45 50.5,25.45 | 50.5,25.45 50.6,25.45 | v25.3,16.46 23.47,18.29 23.47,18.9 U$12.4 | U1.4 53.19,40.39 56.84,40.39 57.45,39.78 58.98,39.78 59.28,39.47 59.28,30.63 57.65,29 53.5,29 52,27.5 52,25.5 51.95,25.45 50.5,25.45
  Bottom 0.152: v42.06,25.45 33.07,16.46 v25.3,16.46
QP0
  Top 0.152: U$4.P$12 8.84,17.07 14.48,17.07 20.88,10.67 23.47,10.67 24.54,9.6 24.54,9.14 U$11.4
QP1  (via drill 0.33)
  Top 0.152: v5.03,15.09 5.03,16.31 5.49,16.76 6.71,16.76 U$4.P$13 | v15.24,10.21 16.15,10.21 19.36,7.01 23.01,7.01 23.32,7.32 23.32,8.99 U$11.5
  Bottom 0.152: v5.03,15.09 5.51,15.09 9.17,11.43 14.02,11.43 v15.24,10.21
QP2
  Top 0.152: U$4.P$14 8.84,16.46 14.63,16.46 20.73,10.36 21.34,10.36 21.95,9.75 21.95,9.14 U$11.6
QP2@2
  Top 0.152: U$4.P$37 6.86,9.6 7.16,9.6 7.47,9.91 7.47,10.06 8.38,10.97 8.69,10.97 U$4.P$32 8.84,10.97 13.56,10.97 14.33,10.21 14.33,9.75 17.68,6.4 24.99,6.4 25.3,6.71 25.3,12.04 25.6,12.34 25.6,13.41 25.3,13.72 25.3,14.33 25.91,14.94 25.91,18.9 U$12.6
QP3  (via drill 0.33)
  Top 0.152: v5.79,16.15 6.71,16.15 U$4.P$15 | v14.63,12.34 17.98,12.34 20.73,9.6 20.73,9.14 U$11.7
  Bottom 0.152: v5.79,16.15 9.6,12.34 v14.63,12.34
QP4  (via drill 0.33)
  Top 0.152: v22.71,7.62 19.2,7.62 16,10.82 15.24,10.82 10.21,15.85 8.84,15.85 U$4.P$16 | v25.6,4.72 25.6,3.2 25.76,3.05 U$11.14
  Bottom 0.152: v25.6,4.72 v22.71,7.62
QP5
  Top 0.152: U$4.P$17 6.71,15.54 6.4,15.54 4.88,14.02 4.88,7.62 10.82,1.68 22.55,1.68 22.71,1.83 22.71,3.96 23.01,4.27 23.77,4.27 24.54,3.5 24.54,3.05 U$11.13
QP6
  Top 0.152: U$4.P$18 8.69,15.39 8.53,15.39 7.92,16 7.92,20.12 10.06,22.25 14.48,22.25 19.36,27.13 21.79,27.13 22.71,26.21 22.71,23.93 26.52,20.12 26.52,11.43 26.21,11.12 26.21,10.52 26.52,10.21 26.52,7.92 25.6,7.01 25.6,5.64 24.99,5.03 24.99,4.27 25.3,3.96 25.3,1.83 25.15,1.68 24.08,1.68 23.47,2.29 23.47,2.9 U$11.12
QP6@2  (via drill 0.33)
  Top 0.152: U$4.P$28 8.69,12.34 7.47,12.34 7.32,12.5 6.86,12.5 U$4.P$27 | 6.4,12.5 6.71,12.5 U$4.P$27 | v13.72,9.91 11.12,7.32 6.1,7.32 5.49,7.92 5.49,12.6 U$4.P$27 | v26.06,22.86 26.06,23.16 24.69,24.54 24.69,24.99 U$12.12
  Bottom 0.152: v13.72,9.91 14.63,9.91 14.94,9.6 15.54,9.6 26.06,20.12 v26.06,22.86
QP7
  Top 0.152: U$4.P$19 6.71,14.94 6.4,14.94 5.18,13.72 5.18,7.77 8.69,4.27 21.18,4.27 21.95,3.5 21.95,3.05 U$11.11
QP7@2  (via drill 0.33)
  Top 0.152: U$4.P$33 6.71,10.67 6.25,10.67 5.79,10.21 5.79,8.08 6.25,7.62 7.77,7.62 8.69,8.53 8.69,9.3 U$4.P$38 8.84,9.45 9.3,9.45 9.45,9.6 v12.5,9.6 | v27.58,21.34 27.58,22.25 25.91,23.93 25.91,24.99 U$12.11
  Bottom 0.152: v27.58,21.34 26.36,20.12 26.36,19.96 15.7,9.3 12.8,9.3 v12.5,9.6
RESET  (via drill 0.33, 0.35)
  Top 0.152: X1.1 9.45,58.52 6.4,58.52 6.1,58.83 ESPDEBUG_1.1 | R21.1 66.14,49.68 66.14,50.44 68.73,53.03 68.73,55.63 S2.1 | v25.45,61.11 25.91,61.11 30.94,66.14 43.18,66.14 v44.66,64.66 | S2.2 68.73,62.33 66.06,65 65,65 64,66 v63.5,66
  Bottom 0.152: 10.36,55.02 6.55,58.83 6.1,58.83 ESPDEBUG_1.1 | 10.36,55.02 13.41,51.97 13.41,51.21 JP3.1 | S2.2 68.89,62.18 68.89,60.35 69.49,59.74 69.49,57.61 68.89,57 68.89,55.78 S2.1 | 10.36,55.02 14.94,59.59 25.15,59.59 25.45,59.89 v25.45,61.11 | v44.66,64.66 44.84,64.66 46.5,63 56,63 56.5,63.5 56.5,65.5 57.47,66.47 63.03,66.47 v63.5,66
RXD
  Top 0.152: 33.83,51.21 33.83,47.4 34.75,46.48 35.36,46.48 35.66,46.79 35.66,48.01 U$13.6 | 33.83,51.21 35.36,52.73 D3.A | X1.15 24.54,56.39 27.89,56.39 ESPDEBUG_2.2 28.04,56.24 28.35,56.24 33.38,51.21 33.83,51.21
RXD_5V
  Top 0.152: D3.C 35.51,56.54 35.51,60.66 36.88,62.03 JP1.2
SPH  (via drill 0.33)
  Top 0.152: v16.61,30.48 16.31,30.18 16.31,28.04 16.92,27.43 21.95,27.43 23.32,26.06 23.32,25.15 U$12.13 | U$4.P$11 5.4,17.4 5,17 4,17 4,19.24 v4.42,19.66
  Bottom 0.152: v4.42,19.66 4.42,21.95 12.95,30.48 v16.61,30.48
TXD
  Top 0.152: X1.16 24.54,58.52 27.58,58.52 27.89,58.83 ESPDEBUG_2.1 28.04,58.98 31.09,62.03 34.29,62.03 JP1.1
VBAT  (via drill 0.33)
  Top 0.152: U$13.3 34.44,49.99 34.44,50.29 38.1,53.95 38.41,53.95 R1.1 38.56,54.1 38.56,57.91 C8.1 38.56,58.06 38.56,60.66 38.41,60.81 38.41,63.25 39.01,63.86 43.28,63.86 46.18,60.96 46.18,58.82 48,57 52.23,57 52.25,57.02 | 52.88,56.39 52.88,52.88 D2.A | 52.25,57.02 51.05,58.22 BAT_CON.1 50.9,58.37 50.9,59.59 | 52.25,57.02 52.88,56.39 | 52.88,56.39 53.34,56.39 60.81,63.86 61.27,63.86 BAT_PIN.1 | v70.26,37.95 69.04,37.95 U2.10 | v73.61,37.95 74.07,37.95 79.25,43.13 85.19,43.13 86.11,44.04 | 86.11,44.04 86.11,46.94 85.11,46.94 CHRG/LBO.A | v62.18,42.82 51.66,42.82 50.9,43.59 49.99,43.59 Q1.2 | POWERGOOD.A 85.15,45 86.11,44.04
  Bottom 0.152: v73.61,37.95 v70.26,37.95 65.38,42.82 v62.18,42.82 61.42,43.59 61.42,63.86 BAT_PIN.1
VCC
  Top 0.152: U$14.1 53.95,46.33 53.95,48.16 53.03,49.07 D2.C 52.88,49.23 49.84,52.27 49.07,52.27 R22.1 48.92,52.43 48.92,53.65 46.02,56.54 45.26,56.54 39.78,62.03 39.47,62.03 JP1.3
VCOMMON  (via drill 0.33)
  Top 0.152: IC2.1 45.41,22.86 45.41,21.64 IC2.2 45.41,21.49 46.02,21.49 46.79,20.73 46.79,19.96 46.48,19.66 44.2,19.66 44.04,19.51 44.04,16.46 44.96,15.54 C7.1 44.96,15.39 44.96,14.63 42.37,12.04 36.42,12.04 31.39,7.01 v26.52,7.01 | v24.69,7.01 24.38,6.71 17.83,6.71 14.63,9.91 14.63,10.36 10.82,14.17 8.84,14.17 U$4.P$22
  Bottom 0.152: v26.52,7.01 v24.69,7.01
VDD  (via drill 0.33)
  Top 0.152: U$4.P$36 8.69,9.75 8.38,9.75 7.92,9.3 7.92,8.23 7.62,7.92 6.4,7.92 6.1,8.23 6.1,9.91 6.25,10.06 6.71,10.06 U$4.P$35 6.86,10.21 7.16,10.21 7.47,10.52 7.47,11.73 | U$4.P$4 8.69,19.36 8.38,19.36 8.23,19.2 8.23,18.59 8.38,18.44 8.69,18.44 U$4.P$8 8.84,18.29 8.84,17.83 U$4.P$10 8.84,17.68 v9.75,17.68 | 7.47,11.73 8.69,11.73 U$4.P$30 8.84,11.73 9.6,11.73 10.52,12.65 v10.52,13.56 | 7.47,11.73 7.32,11.89 6.86,11.89 U$4.P$29 | v7.01,22.71 4.27,25.45 3.05,25.45 C12.1 | v23.32,28.35 24.23,29.26 25.6,29.26 Q2.3 | v21.49,26.52 21.49,25.76 20.88,25.15 U$12.15 20.73,25.15 19.66,25.15 U$12.16 | v24.54,23.47 27.74,20.27 27.74,17.83 28.35,17.22 28.35,9.14 U$11.1
  Bottom 0.152: v10.52,13.56 9.75,14.33 v9.75,17.68 9.75,19.66 | v7.01,22.71 9.75,19.96 9.75,19.66 | v21.49,26.52 v23.32,28.35 | v21.49,26.52 v24.54,23.47 | 9.75,19.66 14.63,19.66 v21.49,26.52

### Text on the board
tPlace: GPIO0 | RST | + | BOOT | RST | TXD | ADC | RXD | BATTERY | CH_PD | OE | 16 | CL | 14 | 0 | DONE | CHRG | 12 | B_EN | PWRG | 13 | 15 | 3V3 | GND | PANEL | + | +
bPlace: RST to 16 | EN TO GND
bStop: Rev 1.6 | Project WISE | Board by